# EAGLE design GeniusTop (EAGLE 9.6.2)
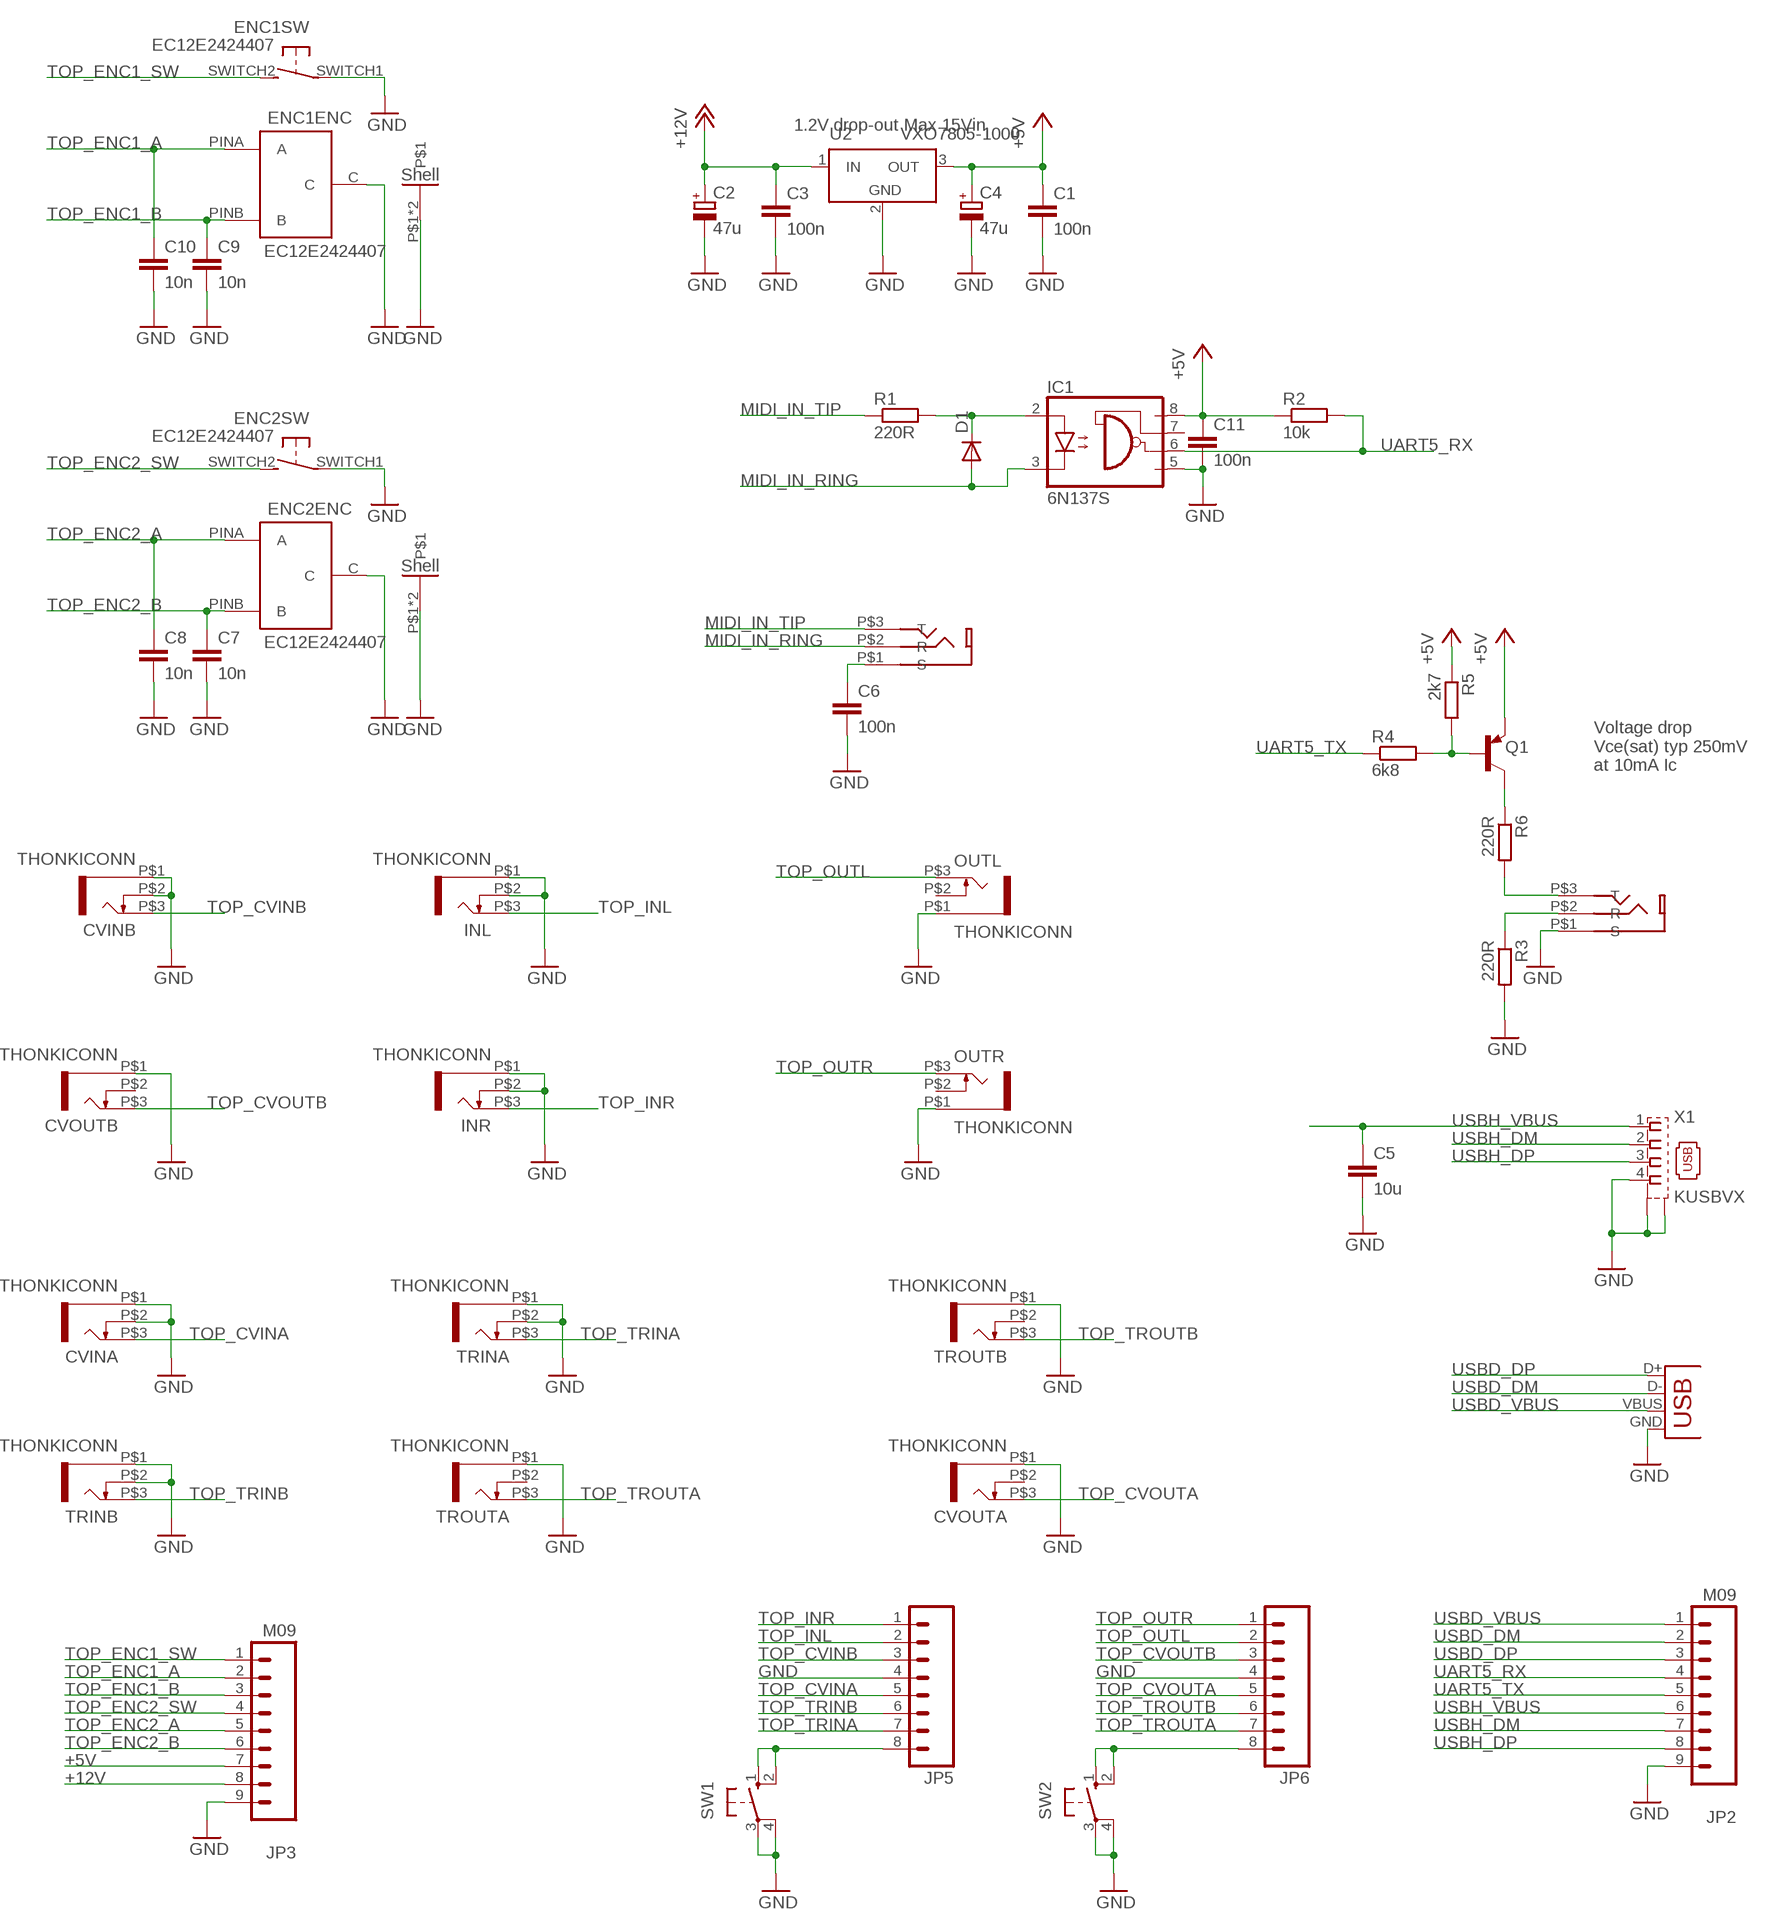
[diagram p0: schematic, sheet 1]

## Parts
C1  100n  C-EUC0603  [C0603]
C2  47u  CPOL-EU153CLV-0505  [CPOL-5]
C3  100n  C-EUC0603  [C0603]
C4  47u  CPOL-EU153CLV-0505  [CPOL-5]
C5  10u  C-EUC1206  [C1206]
C6  100n  C-EUC0603  [C0603]
C7  10n  C-EUC0603  [C0603]
C8  10n  C-EUC0603  [C0603]
C9  10n  C-EUC0603  [C0603]
C10  10n  C-EUC0603  [C0603]
C11  100n  C-EUC0603  [C0603]
CVINA  THONKICONN  [THONKICONN]
CVINB  THONKICONN  [THONKICONN]
CVOUTA  THONKICONN  [THONKICONN]
CVOUTB  THONKICONN  [THONKICONN]
D1  DIODESOD-123  [SOD-123]
ENC1  EC12E2424407  [EC12E2424407]
ENC2  EC12E2424407  [EC12E2424407]
IC1  6N137S  [DIL8-SMD]
INL  THONKICONN  [THONKICONN]
INR  THONKICONN  [THONKICONN]
JP2  M09  [1X09]
JP3  M09  [1X09]
JP5  M081X08  [1X08]
JP6  M081X08  [1X08]
MIDI_IN  THONKICONN_STEREO  [THONKICONN_STEREO]
MIDI_OUT  THONKICONN_STEREO  [THONKICONN_STEREO]
OUTL  THONKICONN  [THONKICONN]
OUTR  THONKICONN  [THONKICONN]
Q1  MMBT3906LT1-PNP-SOT23-BEC  [SOT23-BEC]
R1  220R  R-EU_R0603  [0603]
R2  10k  R-EU_R0603  [0603]
R3  220R  R-EU_R0603  [0603]
R4  6k8  R-EU_R0603  [0603]
R5  2k7  R-EU_R0603  [0603]
R6  220R  R-EU_R0603  [0603]
SW1  10-XX  [B3F-10XX]
SW2  10-XX  [B3F-10XX]
TRINA  THONKICONN  [THONKICONN]
TRINB  THONKICONN  [THONKICONN]
TROUTA  THONKICONN  [THONKICONN]
TROUTB  THONKICONN  [THONKICONN]
U2  VXO7805-1000  TSR-1-2450  [TSR-1-2450]
X1  KUSBVX  [KUSBVX]
X2  USBPTH-VERTICAL  [USB-B-PTH-VERTICAL]

## Nets
+5V: C1.1 C4.+ C11.1 IC1.8(VCC) JP3.7 Q1.E R2.1 R5.1 U2.3(OUT)
+12V: C2.+ C3.1 JP3.8 U2.1(IN)
GND: C1.2 C2.- C3.2 C4.- C5.2 C6.2 C7.2 C8.2 C9.2 C10.2 C11.2 CVINA.P$1 CVINA.P$2 CVINB.P$1 CVINB.P$2 CVOUTA.P$1 CVOUTB.P$1 ENC1.C(ENC:C) ENC1.P$1 ENC1.P$2 ENC1.SWITCH1(SW:P) ENC2.C(ENC:C) ENC2.P$1 ENC2.P$2 ENC2.SWITCH1(SW:P) IC1.5(GND) INL.P$1 INL.P$2 INR.P$1 INR.P$2 JP2.9 JP3.9 JP5.4 JP6.4 MIDI_OUT.P$1(S) OUTL.P$1 OUTR.P$1 R3.2 SW1.3(P) SW1.4(P1) SW2.3(P) SW2.4(P1) TRINA.P$1 TRINA.P$2 TRINB.P$1 TRINB.P$2 TROUTA.P$1 TROUTB.P$1 U2.2(GND) X1.4 X1.M1(S1) X1.M2(S2) X2.GND
MIDI_IN_RING: D1.A IC1.3(C) MIDI_IN.P$2(R)
MIDI_IN_TIP: MIDI_IN.P$3(T) R1.1
MIDI_OUT_TIP: MIDI_OUT.P$3(T) R6.2
N$1: D1.C IC1.2(A) R1.2
N$2: C6.1 MIDI_IN.P$1(S)
N$3: JP5.8 SW1.1(S) SW1.2(S1)
N$4: JP6.8 SW2.1(S) SW2.2(S1)
N$5: Q1.B R4.2 R5.2
N$6: MIDI_OUT.P$2(R) R3.1
N$7: Q1.C R6.1
TOP_CVINA: CVINA.P$3 JP5.5
TOP_CVINB: CVINB.P$3 JP5.3
TOP_CVOUTA: CVOUTA.P$3 JP6.5
TOP_CVOUTB: CVOUTB.P$3 JP6.3
TOP_ENC1_A: C10.1 ENC1.PINA(ENC:A) JP3.2
TOP_ENC1_B: C9.1 ENC1.PINB(ENC:B) JP3.3
TOP_ENC1_SW: ENC1.SWITCH2(SW:S) JP3.1
TOP_ENC2_A: C8.1 ENC2.PINA(ENC:A) JP3.5
TOP_ENC2_B: C7.1 ENC2.PINB(ENC:B) JP3.6
TOP_ENC2_SW: ENC2.SWITCH2(SW:S) JP3.4
TOP_INL: INL.P$3 JP5.2
TOP_INR: INR.P$3 JP5.1
TOP_OUTL: JP6.2 OUTL.P$3
TOP_OUTR: JP6.1 OUTR.P$3
TOP_TRINA: JP5.7 TRINA.P$3
TOP_TRINB: JP5.6 TRINB.P$3
TOP_TROUTA: JP6.7 TROUTA.P$3
TOP_TROUTB: JP6.6 TROUTB.P$3
UART5_RX: IC1.6(VO) JP2.4 R2.2
UART5_TX: JP2.5 R4.1
USBD_DM: JP2.2 X2.D-
USBD_DP: JP2.3 X2.D+
USBD_VBUS: JP2.1 X2.VBUS
USBH_DM: JP2.7 X1.2
USBH_DP: JP2.8 X1.3
USBH_VBUS: C5.1 JP2.6 X1.1
Unconnected: CVOUTA.P$2 CVOUTB.P$2 IC1.7(VE) OUTL.P$2 OUTR.P$2 TROUTA.P$2 TROUTB.P$2

## Notes on the sheet
- 1.2V drop-out Max 15Vin
- Voltage drop
  Vce(sat) typ 250mV
  at 10mA Ic

## Library data of the parts
C1 C3 C5-C11 = Rebel:C-EU: CAPACITOR, European symbol
C2 C4 = Rebel:CPOL-EU: POLARIZED CAPACITOR, European symbol
CVINA CVINB CVOUTA CVOUTB INL INR OUTL OUTR TRINA TRINB TROUTA TROUTB = Rebel:THONKICONN
D1 = adafruit:DIODE: Diode SMADIODE - SMA Surface Mount Package 20V 1A Schottky Diode Digikey: 641-1014-6-ND DO-1N4148 - Through Hole Small Current Diode SOD-123 20V 1 A (.5mV Vf) Schottky Diode - Digikey: MBRX120TPMSCT-ND SOD-323 10V 570mA (.38mV Vf, 3ns) Schottky Diode - Digikey: ZLLS410CT-ND SOD-523 30V 30mA Schottky Diode (RB751S-40TE61) - Digikey: RB751S-40TE61CT-ND SOT23-R/W - SOT23 Package (R = Solder Paste/Reflow Ovens, W = Hand-Soldering) BAT54Film 40V 300mA - Digikey: 497-7162-1-ND
ENC1 ENC2 = Rebel:EC12E2424407: rotary encoder with switch EC12E2424407
IC1 = optocoupler:6N137: MOTOROLA OPTO COUPLER
JP2 JP3 = SparkFun:M09: Header 9 Standard 9-pin 0.1" header. Use with straight break away headers (SKU : PRT-00116), right angle break away headers (PRT-00553), swiss pins (PRT-00743), machine pins (PRT-00117), and female headers (PRT-00115).
JP5 JP6 = SparkFun:M08: Header 8 Standard 8-pin 0.1" header. Use with straight break away headers (SKU : PRT-00116), right angle break away headers (PRT-00553), swiss pins (PRT-00743), machine pins (PRT-00117), and female headers (PRT-00115).
MIDI_IN MIDI_OUT = Rebel:THONKICONN_STEREO
Q1 = transistor:*-PNP-: PNP Transistror
R1-R6 = Rebel:R-EU_: RESISTOR, European symbol
SW1 SW2 = switch-omron:10-XX: OMRON SWITCH; MPN: B3F-1000; OC_FARNELL: 176432; OC_NEWARK: 36M3542
U2 = Hangar:TSR-1-2450
X1 = con-kycon:KUSBVX: Vertical,Top Entry Universal Serial Bus Connector KUSBVX Series Source: KYCON Sibalco USB vertical socket KUSBV.pdf
X2 = SparkFun:USB: USB Connectors USB-B-PTH is fully proven SKU : PRT-00139 USB-miniB is fully proven SKU : PRT-00587 USB-A-PCB is untested. USB-A-H is throughly reviewed, but untested. Spark Fun Electronics SKU : PRT-00437 USB-B-SMT is throughly reviewed, but untested. Needs silkscreen touching up. USB-A-S has not been used/tested USB-MB-H has not been used/tested

## Net classes
1 power: width 0.178 mm, drill 0.305 mm, clearance 0.178 mm to class 0, clearance 0.178 mm

## Board
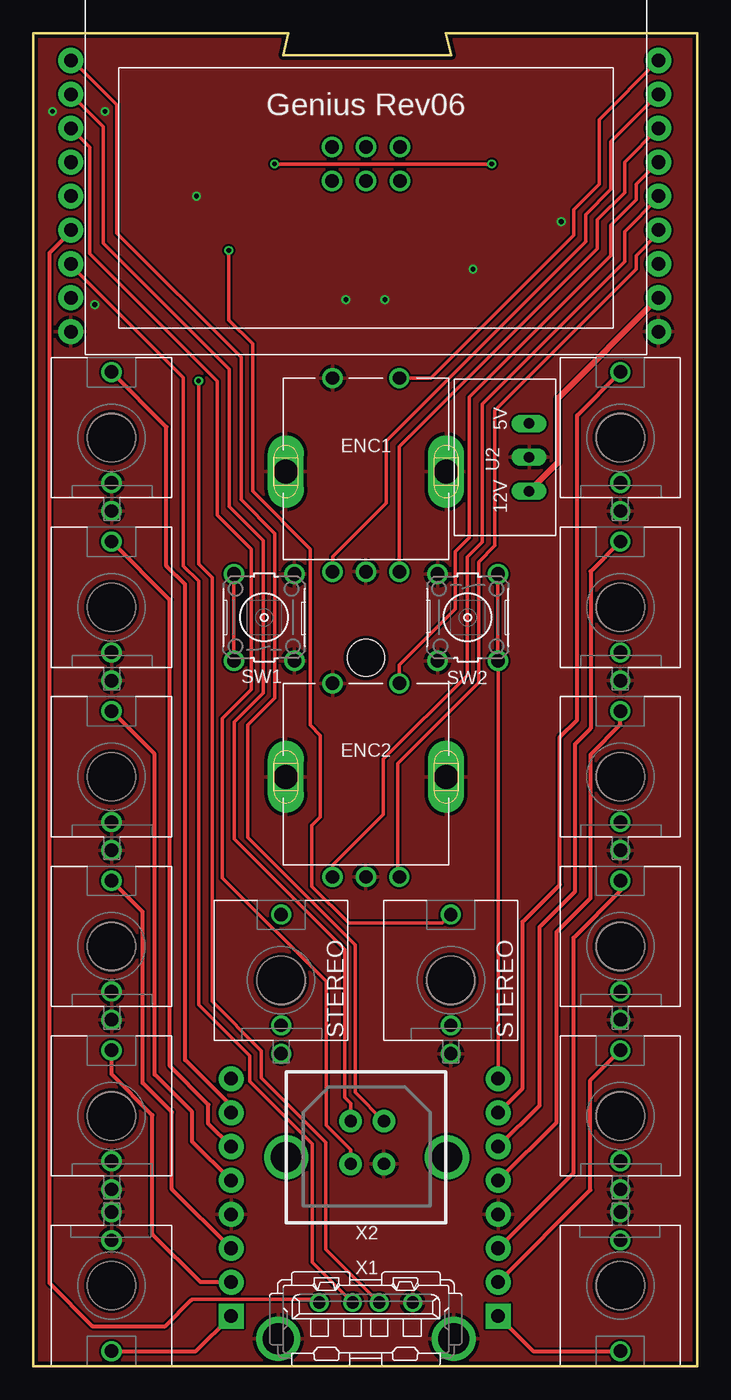
[diagram p1: board, top side]
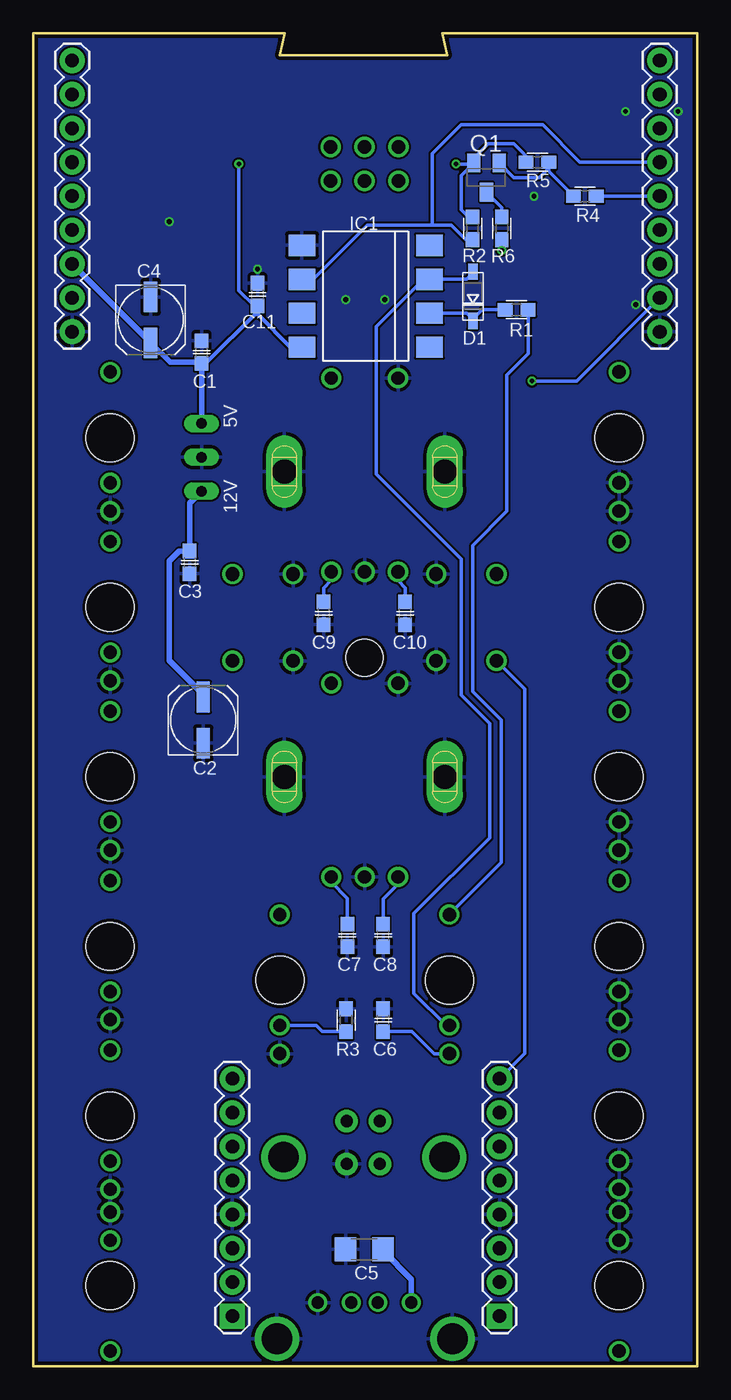
[diagram p2: board, bottom side, seen from below]

Size 49.7 x 99.82 mm. Coordinates in mm from the lower left corner, seen from the top.
Outline: 49.7,99.82 30.89,99.82 31.27,98.17 18.7,98.17 19.08,99.82 0,99.82 0,0 49.7,0 49.7,99.82
Copper layers (1*16): Top 0.035mm / dielectric 1.5mm / Bottom 0.035mm
Design rules "SeeedStudio_2layer_DRU_no_angle_20140221": minimum track width 6mil, minimum drill 12mil, track to track 6mil, track to pad 6mil, pad to pad 6mil, via to via 6mil, smd to smd 0mil, copper to edge 10mil, drill to drill 10mil, minimum pad ring 10mil, minimum via ring 6mil, stop-mask expansion 2mil, vias tented up to drill 100mil, thermal gap 10mil
Holes 2.8 mm at 24.9,53.05

### Footprints (pad centres in the part's own frame; a part is rotated, then mirrored left to right if it is on the bottom)
C0603 = smd 1.1 x 1: 1 -0.85,0; 2 0.85,0
CPOL-5 = smd 2.3 x 1: + 1.725,0; - -1.725,0
C1206 = smd 1.6 x 1.8: 1 -1.4,0; 2 1.4,0
THONKICONN = drill 1: P$1 0,-5.5; P$2 0,-3.38; P$3 0,4.92 | hole 3.6: 0,0
SOD-123 = smd 1.2 x 0.7: A 1.85,0; C -1.85,0
EC12E2424407 = drill 1: C 0,-7.5; PINA -2.5,-7.5; PINB 2.5,-7.5; SWITCH1 -2.5,7; SWITCH2 2.5,7 | drill 1.8 long: P$1 -6,0; P$2 6,0
OLED_128X64_1_54@1 = drill 1.016: P$1 -2.54,-1.27; P$2 0,-1.27; P$3 2.54,-1.27; P$4 -2.54,-3.81; P$5 0,-3.81; P$6 2.54,-3.81
DIL8-SMD = smd 1.6 x 2: 1 -3.81,-4.77; 2 -1.27,-4.77; 3 1.27,-4.77; 4 3.81,-4.77; 5 3.81,4.77; 6 1.27,4.77; 7 -1.27,4.77; 8 -3.81,4.77
1X09 = drill 1.016 pad 1.88: 1 0,0; 2 2.54,0; 3 5.08,0; 4 7.62,0; 5 10.16,0; 6 12.7,0; 7 15.24,0; 8 17.78,0; 9 20.32,0
1X08 = drill 1.016 pad 1.88 square: 1 0,0 | drill 1.016 pad 1.88: 2 2.54,0; 3 5.08,0; 4 7.62,0; 5 10.16,0; 6 12.7,0; 7 15.24,0; 8 17.78,0
THONKICONN_STEREO = drill 1: P$1 0,-5.5; P$2 0,-3.38; P$3 0,4.92 | hole 3.6: 0,0
SOT23-BEC = smd 1 x 1.4: B -0.95,-1.1; C 0,1.1; E 0.95,-1.1
0603 = smd 1.1 x 1: 1 -0.85,0; 2 0.85,0
B3F-10XX = drill 1.016: 1 -3.251,2.261; 2 3.251,2.261; 3 -3.251,-2.261; 4 3.251,-2.261
TSR-1-2450 = drill 0.8 long: 1 -2.54,0; 2 0,0; 3 2.54,0
KUSBVX = drill 0.9 pad 1.3: 1 3.5,0; 2 1,0; 3 -1,0; 4 -3.5,0 | drill 2.3 pad 2.8: M1 -6.57,2.71; M2 6.57,2.71
USB-B-PTH-VERTICAL = drill 0.914 pad 1.676: D+ -1.143,-1.257; D- -1.143,1.943; GND 1.346,-1.257; VBUS 1.346,1.943 | drill 2.286: P$1 -5.969,-0.749; P$2 6.071,-0.749

### Placement (x,y rotation side)
C1  37.11,75.95 90 bottom
C2  36.98,48.39 90 bottom
C3  38,60.2 270 bottom
C4  40.92,78.36 270 bottom
C5  24.92,8.76 180 bottom
C6  23.52,25.91 90 bottom
C7  26.19,32.26 270 bottom
C8  23.52,32.26 270 bottom
C9  27.97,56.39 270 bottom
C10  21.87,56.39 270 bottom
C11  32.92,80.26 90 bottom
CVINA  5.85,44.14 0 top
CVINB  5.85,31.44 0 top
CVOUTA  43.95,44.14 0 top
CVOUTB  43.95,31.44 0 top
D1  16.79,80.14 90 bottom
ENC1  24.9,67 0 top
ENC2  24.9,44.14 0 top
HLD1  SCREEN_HOLDER  [OLED_128X64_1_54@1]  24.9,87.5 180 top
IC1  24.82,80.14 90 bottom
INL  5.85,18.74 0 top
INR  5.85,6.04 180 top
JP2  2.8,97.79 270 bottom
JP3  46.8,97.79 270 bottom
JP5  14.8,3.74 90 bottom
JP6  34.8,3.74 90 bottom
MIDI_IN  18.55,28.9 0 top
MIDI_OUT  31.25,28.9 0 top
OUTL  43.95,18.74 0 top
OUTR  43.95,6.04 180 top
Q1  15.78,89.03 180 bottom
R1  13.52,79.12 180 bottom
R2  16.82,85.22 270 bottom
R3  26.29,25.91 90 bottom
R4  8.41,87.63 180 bottom
R5  11.96,90.17 0 bottom
R6  14.63,85.22 270 bottom
SW1  17.28,56.08 90 top
SW2  32.52,56.08 270 top
TRINA  5.85,69.54 0 top
TRINB  5.85,56.84 0 top
TROUTA  43.95,69.54 0 top
TROUTB  43.95,56.84 0 top
U2  37.11,68.07 90 top
X1  24.9,4.76 180 top
X2  24.9,16.4 0 top

### Tracks (layer width: path | path; a pad name or v marks a point on that pad's centre or on a via)
+5V  (via drill 0.35)
  Top 0.254: v34.32,90.04 v18.06,90.04
  Bottom 0.254: R5.1 12.81,90.64 13.74,91.57 15.65,91.57 16.72,90.49 Q1.E | Q1.E 17.68,89.17 17.68,86.63 17.11,86.07 R2.1 | v18.06,90.04 16.81,90.04 Q1.E | C11.1 33.17,79.41 34.32,80.56 v34.32,90.04
  Bottom 0.305: 32.92,78.99 32.92,78.78 30.47,76.33 IC1.8 | 32.92,78.99 C11.1 | C1.1 36.82,75.1 32.92,78.99
  Bottom 0.406: JP3.7 40.92,76.68 C4.+ 39.47,75.18 37.2,75.18 C1.1 U2.3
+12V
  Top 0.406: JP3.8 39.27,72.48 39.27,67.69 U2.1
  Bottom 0.406: U2.1 38,64.64 C3.1 38.76,61.05 39.52,60.29 39.52,52.83 36.98,50.29 C2.+
GND  (via drill 0.35)
  other vias: 23.39,79.88 26.32,79.88 12.22,87.63 32.92,82.17 39.52,85.73 1.42,93.98 5.36,93.98 4.6,79.5
  pour Top: -2.64,100.58 -2.64,-1.02 50.7,-1.02 50.7,100.58
  pour Bottom: -1.37,100.58 -1.37,-1.02 51.97,-1.02 51.97,100.58
MIDI_IN_RING
  Bottom 0.254: MIDI_IN.P$2 18.8,25.52 21.22,27.93 21.22,33.9 15.55,39.57 15.55,48.13 17.68,50.27 17.68,60.45 24.03,66.8 24.03,77.85 20.74,81.14 IC1.3 17.24,81.41 16.79,81.86 D1.A
MIDI_IN_TIP
  Bottom 0.254: MIDI_IN.P$3 14.66,37.71 14.66,48.39 16.82,50.55 16.82,61.47 14.25,64.03 14.25,74.23 12.67,75.82 R1.1
MIDI_OUT_TIP  (via drill 0.35)
  Top 0.254: MIDI_OUT.P$3 30.61,33.18 23.61,33.18 20.85,35.94 20.85,40.51 21.49,41.15 21.49,47.24 20.73,48.01 20.73,61.21 16.41,65.53 16.41,76.58 14.63,78.36 v14.63,83.57
  Bottom 0.254: v14.63,83.57 R6.2
N$1
  Bottom 0.254: R1.2 16.08,79.12 16.79,78.41 | 16.79,78.41 D1.C | IC1.2 17.24,78.87 16.79,78.41
N$2
  Bottom 0.254: MIDI_IN.P$1 19.7,23.4 21.36,25.06 C6.1
N$3
  Top 0.254: SW1.1 SW1.2
  Bottom 0.254: JP5.8 12.89,23.43 12.89,50.7 SW1.1
N$4
  Top 0.254: SW2.1 SW2.2 34.8,52.81 JP6.8
N$5
  Bottom 0.254: R4.2 11.12,89.49 R5.2 11.2,90.08 11.2,89.66 11.84,89.03 13.72,89.03 Q1.B
N$6
  Bottom 0.254: R3.1 28.07,25.06 28.53,25.52 MIDI_OUT.P$2
N$7
  Bottom 0.254: Q1.C 14.63,86.78 R6.1
TOP_CVINA
  Top 0.305: JP5.5 11.89,16.82 11.89,19.03 9.07,21.84 9.07,45.84 CVINA.P$3
TOP_CVINB
  Top 0.305: JP5.3 10.37,13.26 10.37,19.03 8.18,21.21 8.18,34.03 CVINB.P$3
TOP_CVOUTA
  Top 0.305: JP6.5 39.17,18.27 39.17,32.51 41.72,35.06 41.72,45.81 43.95,48.04 CVOUTA.P$3
TOP_CVOUTB
  Top 0.305: JP6.3 40.44,14.46 40.44,32.09 43.95,35.6 CVOUTB.P$3
TOP_ENC1_A
  Top 0.254: ENC1.PINA 22.4,60.64 26.41,64.66 26.41,69.28 41.34,84.2 41.34,86.24 43.24,88.14 43.24,91.7 JP3.2
  Bottom 0.254: ENC1.PINA 22.4,58.82 21.87,58.29 C10.1
TOP_ENC1_B
  Top 0.254: JP3.3 44.26,90.17 44.26,87.89 42.23,85.86 42.23,83.69 27.4,68.87 ENC1.PINB
  Bottom 0.254: C9.1 27.97,58.29 27.4,58.86 ENC1.PINB
TOP_ENC1_SW
  Top 0.254: JP3.1 42.35,93.35 42.35,88.52 40.45,86.62 40.45,84.71 29.74,74 ENC1.SWITCH2
TOP_ENC2_A
  Top 0.254: JP3.5 46.8,87.51 44.26,84.97 44.26,82.73 33.6,72.07 33.6,61.72 32.48,60.61 32.48,51.74 26.21,45.46 26.21,41.34 22.4,37.53 ENC2.PINA
  Bottom 0.254: C8.1 23.52,35.01 22.4,36.13 ENC2.PINA
TOP_ENC2_B
  Top 0.254: JP3.6 46.8,84.84 45.15,83.19 45.15,82.17 34.55,71.57 34.55,61.47 33.33,60.24 33.33,51.2 27.27,45.14 27.27,36.77 ENC2.PINB
  Bottom 0.254: C7.1 26.19,35.04 27.4,36.25 ENC2.PINB
TOP_ENC2_SW
  Top 0.254: JP3.4 45.15,88.52 45.15,87.38 43.24,85.48 43.24,83.19 32.65,72.59 32.65,62.06 31.6,61.01 31.6,56.72 27.4,52.52 ENC2.SWITCH2
TOP_INL
  Top 0.305: INL.P$3 5.85,21.86 8.92,18.8 8.92,9.88 12.51,6.28 JP5.2
TOP_INR
  Top 0.305: INR.P$3 12.18,1.12 JP5.1
TOP_OUTL
  Top 0.305: JP6.2 41.71,13.19 41.71,21.42 OUTL.P$3
TOP_OUTR
  Top 0.305: JP6.1 37.42,1.12 OUTR.P$3
TOP_TRINA
  Top 0.305: JP5.7 14.8,19.49 11.36,22.94 11.36,58.55 9.96,59.94 9.96,70.35 TRINA.P$3
TOP_TRINB
  Top 0.305: TRINB.P$3 10.21,57.39 10.21,22.48 13.11,19.59 13.11,18.14 JP5.6
TOP_TROUTA
  Top 0.305: JP6.7 36.63,20.81 36.63,33.27 39.41,36.05 39.41,47.1 40.7,48.4 40.7,71.21 TROUTA.P$3
TOP_TROUTB
  Top 0.305: JP6.6 37.9,19.54 37.9,32.89 40.55,35.55 40.55,46.6 41.72,47.76 41.72,59.53 TROUTB.P$3
UART5_RX
  Bottom 0.254: JP2.4 8.79,90.17 11.58,92.96 17.68,92.96 19.84,90.81 19.84,85.6 | R2.2 17.33,84.37 18.43,85.47 19.71,85.47 | 19.97,85.47 24.69,85.47 28.76,81.41 IC1.6 | 19.97,85.47 19.71,85.47 | 19.84,85.6 19.97,85.47 | 19.84,85.6 19.71,85.47
UART5_TX
  Bottom 0.254: JP2.5 R4.1
USBD_DM
  Top 0.254: JP2.2 5.24,92.82 5.24,84.1 14.66,74.68 14.66,64.39 17.2,61.85 17.2,50.42 15.04,48.26 15.04,39.5 23.32,31.21 23.32,20.11 23.76,19.68 X2.D-
USBD_DP
  Top 0.254: JP2.3 4.22,91.29 4.22,83.33 13.77,73.79 13.77,63.75 16.31,61.21 16.31,50.67 14.15,48.51 14.15,36.58 21.92,28.8 21.92,18.03 23.76,16.2 X2.D+
USBD_VBUS
  Top 0.254: JP2.1 2.93,97.79 6.26,94.47 6.26,84.86 15.55,75.57 15.55,64.9 18.09,62.36 18.09,50.04 16.06,48.01 16.06,39.6 24.09,31.57 24.09,20.5 X2.VBUS
USBH_DM
  Top 0.254: X1.2 20.88,7.78 20.88,16.64 16.18,21.34 16.18,23.24 12.37,27.05 12.37,58.8 11.23,59.94 11.23,74.04 2.8,82.47 JP2.7
USBH_DP  (via drill 0.35)
  Top 0.254: X1.3 21.9,8.76 21.9,16.76 17.07,21.59 17.07,23.62 13.39,27.3 13.39,59.05 12.37,60.07 v12.37,73.79
  Bottom 0.254: JP2.8 9.02,73.79 v12.37,73.79
USBH_VBUS
  Top 0.254: 11.84,4.95 11.87,4.99 21.17,4.99 X1.1
  Top 0.305: JP2.6 2.8,84.97 1.2,83.36 1.2,6.22 4.42,3 9.88,3 11.84,4.95
  Bottom 0.406: X1.1 21.4,6.51 23.52,8.63 C5.1

### Text on the board
tPlace: Genius Rev06 | 5V | 12V
bPlace: 5V | 12V